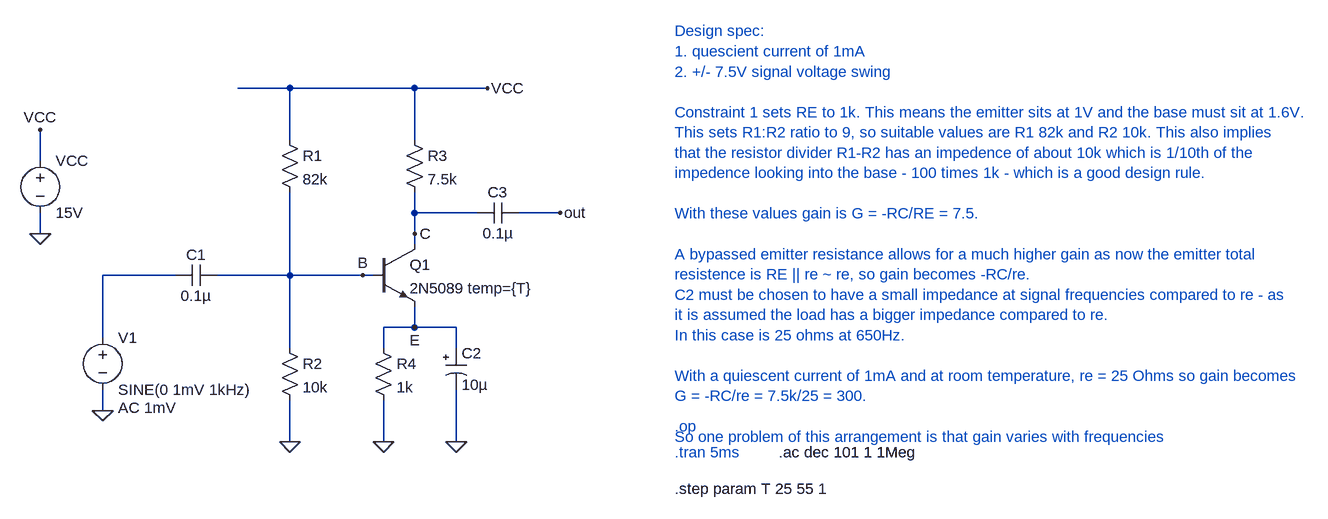
[diagram p0: schematic Figure2.37.asc]
Figure2.37.asc, the LTspice schematic file:
Version 4
SHEET 1 1716 680
WIRE 80 -144 0 -144
WIRE 272 -144 80 -144
WIRE 384 -144 272 -144
WIRE 80 -64 80 -144
WIRE 272 -64 272 -144
WIRE -304 -32 -304 -80
WIRE 272 48 272 16
WIRE 368 48 272 48
WIRE 496 48 432 48
WIRE -304 80 -304 48
WIRE 272 80 272 48
WIRE 272 96 272 80
WIRE -96 144 -208 144
WIRE 80 144 80 16
WIRE 80 144 -32 144
WIRE 192 144 80 144
WIRE 208 144 192 144
WIRE 272 224 272 192
WIRE 272 224 224 224
WIRE 336 224 272 224
WIRE -208 240 -208 144
WIRE 80 256 80 144
WIRE 224 256 224 224
WIRE 336 256 336 224
WIRE -208 352 -208 320
WIRE 80 400 80 336
WIRE 224 400 224 336
WIRE 336 400 336 320
FLAG 80 400 0
FLAG 224 400 0
FLAG -304 80 0
FLAG -304 -80 VCC
FLAG 384 -144 VCC
FLAG 336 400 0
FLAG 496 48 out
FLAG -208 352 0
FLAG 192 144 B
FLAG 272 80 C
FLAG 272 224 E
DATAFLAG 272 48 ""
SYMBOL res 64 -80 R0
SYMATTR InstName R1
SYMATTR Value 82k
SYMBOL res 64 240 R0
SYMATTR InstName R2
SYMATTR Value 10k
SYMBOL npn 208 96 R0
SYMATTR InstName Q1
SYMATTR Value 2N5089 temp={T}
SYMBOL res 256 -80 R0
SYMATTR InstName R3
SYMATTR Value 7.5k
SYMBOL res 208 240 R0
SYMATTR InstName R4
SYMATTR Value 1k
SYMBOL voltage -208 224 R0
WINDOW 123 24 124 Left 2
WINDOW 39 0 0 Left 0
SYMATTR Value2 AC 1mV
SYMATTR InstName V1
SYMATTR Value SINE(0 1mV 1kHz)
SYMBOL voltage -304 -48 R0
WINDOW 123 0 0 Left 0
WINDOW 39 0 0 Left 0
SYMATTR InstName VCC
SYMATTR Value 15V
SYMBOL cap -32 128 R90
WINDOW 0 0 32 VBottom 2
WINDOW 3 32 32 VTop 2
SYMATTR InstName C1
SYMATTR Value 0.1µ
SYMBOL polcap 320 256 R0
SYMATTR InstName C2
SYMATTR Value 10µ
SYMBOL cap 432 32 R90
WINDOW 0 0 32 VBottom 2
WINDOW 3 32 32 VTop 2
SYMATTR InstName C3
SYMATTR Value 0.1µ
TEXT 672 376 Left 2 ;.op
TEXT 672 -232 Left 2 ;Design spec:\n1. quescient current of 1mA\n2. +/- 7.5V signal voltage swing\n \nConstraint 1 sets RE to 1k. This means the emitter sits at 1V and the base must sit at 1.6V.\nThis sets R1:R2 ratio to 9, so suitable values are R1 82k and R2 10k. This also implies\nthat the resistor divider R1-R2 has an impedence of about 10k which is 1/10th of the \nimpedence looking into the base - 100 times 1k - which is a good design rule.\n \nWith these values gain is G = -RC/RE = 7.5. \n \nA bypassed emitter resistance allows for a much higher gain as now the emitter total \nresistence is RE || re ~ re, so gain becomes -RC/re.\nC2 must be chosen to have a small impedance at signal frequencies compared to re - as \nit is assumed the load has a bigger impedance compared to re.\nIn this case is 25 ohms at 650Hz.\n \nWith a quiescent current of 1mA and at room temperature, re = 25 Ohms so gain becomes\nG = -RC/re = 7.5k/25 = 300.\n \nSo one problem of this arrangement is that gain varies with frequencies
TEXT 672 416 Left 2 ;.tran 5ms
TEXT 672 472 Left 2 !.step param T 25 55 1
TEXT 832 416 Left 2 !.ac dec 101 1 1Meg

The netlist it stands for:
* Figure2.37.asc
R1 VCC B 82k
R2 B 0 10k
Q1 C B E 0 2N5089 temp={T}
R3 VCC C 7.5k
R4 E 0 1k
V1 N001 0 SINE(0 1mV 1kHz) AC 1mV
VCC VCC 0 15V
C1 B N001 0.1µ
C2 E 0 10µ
C3 out C 0.1µ
.model NPN NPN
.model PNP PNP
.lib standard.bjt
* .op
* Design spec:
* 1. quescient current of 1mA
* 2. +/- 7.5V signal voltage swing
* Constraint 1 sets RE to 1k. This means the emitter sits at 1V and the base must sit at 1.6V.
* This sets R1:R2 ratio to 9, so suitable values are R1 82k and R2 10k. This also implies
* that the resistor divider R1-R2 has an impedence of about 10k which is 1/10th of the
* impedence looking into the base - 100 times 1k - which is a good design rule.
* With these values gain is G = -RC/RE = 7.5.
* A bypassed emitter resistance allows for a much higher gain as now the emitter total
* resistence is RE || re ~ re, so gain becomes -RC/re.
* C2 must be chosen to have a small impedance at signal frequencies compared to re - as
* it is assumed the load has a bigger impedance compared to re.
* In this case is 25 ohms at 650Hz.
* With a quiescent current of 1mA and at room temperature, re = 25 Ohms so gain becomes
* G = -RC/re = 7.5k/25 = 300.
* So one problem of this arrangement is that gain varies with frequencies
* .tran 5ms
.step param T 25 55 1
.ac dec 101 1 1Meg
.backanno
.end